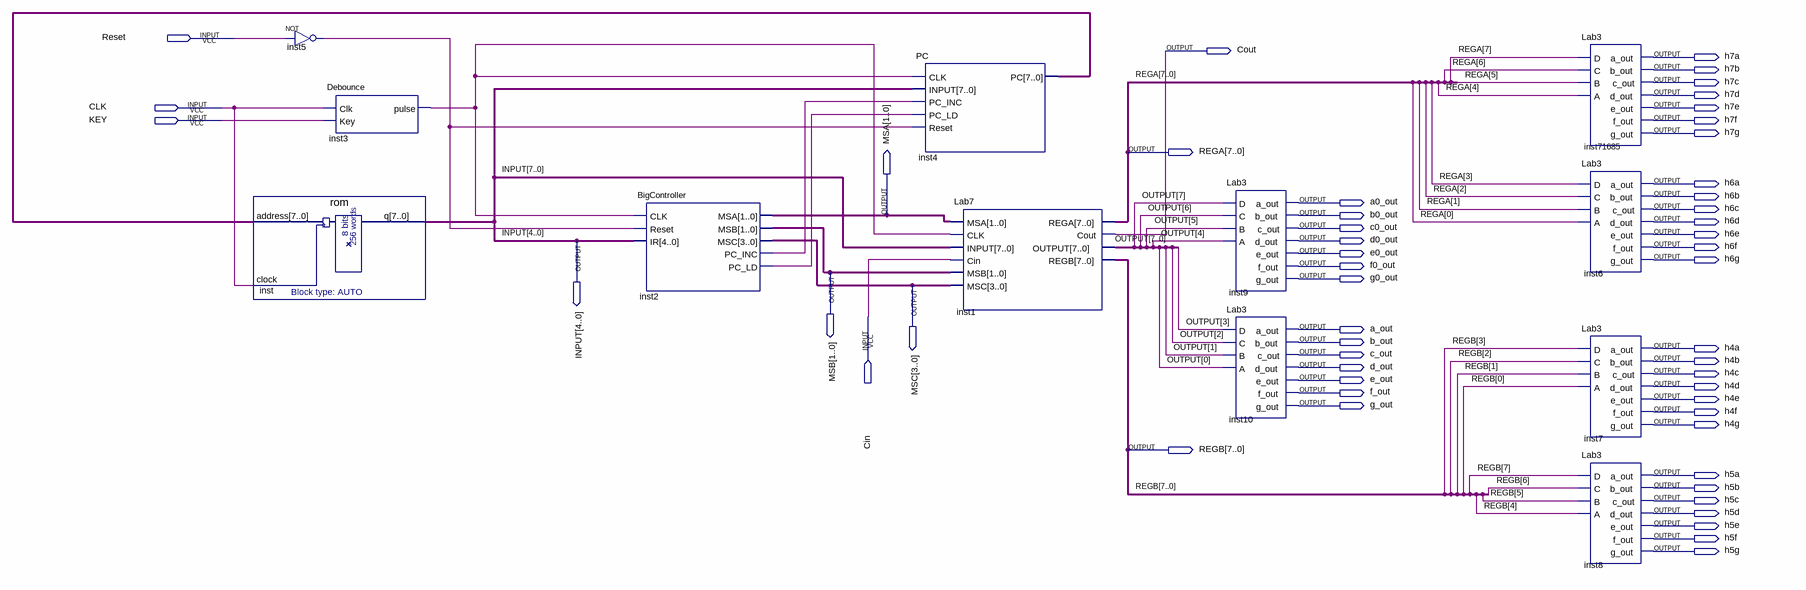
[diagram p0: schematic sheet]
// Quartus schematic Lab9.bdf as structural Verilog: 12 symbols, 53 pins
module Lab9 (
  input  Reset,
  input  CLK,
  input  KEY,
  input  Cin,
  output Cout,
  output h7a,
  output h7b,
  output h7c,
  output h7d,
  output h7e,
  output h7f,
  output h7g,
  output [7:0] REGA,
  output h6a,
  output h6b,
  output a0_out,
  output h6c,
  output [1:0] MSA,
  output b0_out,
  output h6d,
  output c0_out,
  output h6e,
  output [7:0] INPUT,
  output d0_out,
  output h6f,
  output e0_out,
  output h6g,
  output f0_out,
  output [1:0] MSB,
  output g0_out,
  output [3:0] MSC,
  output a_out,
  output b_out,
  output h4a,
  output c_out,
  output h4b,
  output d_out,
  output h4c,
  output e_out,
  output h4d,
  output f_out,
  output h4e,
  output g_out,
  output h4f,
  output h4g,
  output [7:0] REGB,
  output h5a,
  output h5b,
  output h5c,
  output h5d,
  output h5e,
  output h5f,
  output h5g
);

  wire inst2_pc_inc, inst2_pc_ld, inst3_pulse, inst5_out;
  wire [7:0] inst4_pc, OUTPUT;

  rom inst (.address(inst4_pc), .clock(CLK), .q(INPUT));
  not inst5 (inst5_out, Reset);
  Debounce inst3 (.Clk(CLK), .Key(KEY), .pulse(inst3_pulse));
  BigController inst2 (
    .CLK(inst3_pulse), .Reset(inst5_out), .IR(INPUT[4:0]), .MSA(MSA), .MSB(MSB), .MSC(MSC),
    .PC_INC(inst2_pc_inc), .PC_LD(inst2_pc_ld));
  PC inst4 (
    .CLK(inst3_pulse), .INPUT(INPUT), .PC_INC(inst2_pc_inc), .PC_LD(inst2_pc_ld), .Reset(inst5_out),
    .PC(inst4_pc));
  Lab7 inst1 (
    .MSA(MSA), .CLK(inst3_pulse), .INPUT(INPUT), .Cin(Cin), .MSB(MSB), .MSC(MSC), .REGA(REGA), .Cout(Cout),
    .OUTPUT(OUTPUT), .REGB(REGB));
  Lab3 inst9 (
    .D(OUTPUT[7]), .C(OUTPUT[6]), .B(OUTPUT[5]), .A(OUTPUT[4]), .a_out(a0_out), .b_out(b0_out),
    .c_out(c0_out), .d_out(d0_out), .e_out(e0_out), .f_out(f0_out), .g_out(g0_out));
  Lab3 inst10 (
    .D(OUTPUT[3]), .C(OUTPUT[2]), .B(OUTPUT[1]), .A(OUTPUT[0]), .a_out(a_out), .b_out(b_out), .c_out(c_out),
    .d_out(d_out), .e_out(e_out), .f_out(f_out), .g_out(g_out));
  Lab3 inst71685 (
    .D(REGA[7]), .C(REGA[6]), .B(REGA[5]), .A(REGA[4]), .a_out(h7a), .b_out(h7b), .c_out(h7c), .d_out(h7d),
    .e_out(h7e), .f_out(h7f), .g_out(h7g));
  Lab3 inst6 (
    .D(REGA[3]), .C(REGA[2]), .B(REGA[1]), .A(REGA[0]), .a_out(h6a), .b_out(h6b), .c_out(h6c), .d_out(h6d),
    .e_out(h6e), .f_out(h6f), .g_out(h6g));
  Lab3 inst7 (
    .D(REGB[3]), .C(REGB[2]), .B(REGB[1]), .A(REGB[0]), .a_out(h4a), .b_out(h4b), .c_out(h4c), .d_out(h4d),
    .e_out(h4e), .f_out(h4f), .g_out(h4g));
  Lab3 inst8 (
    .D(REGB[7]), .C(REGB[6]), .B(REGB[5]), .A(REGB[4]), .a_out(h5a), .b_out(h5b), .c_out(h5c), .d_out(h5d),
    .e_out(h5e), .f_out(h5f), .g_out(h5g));
endmodule
